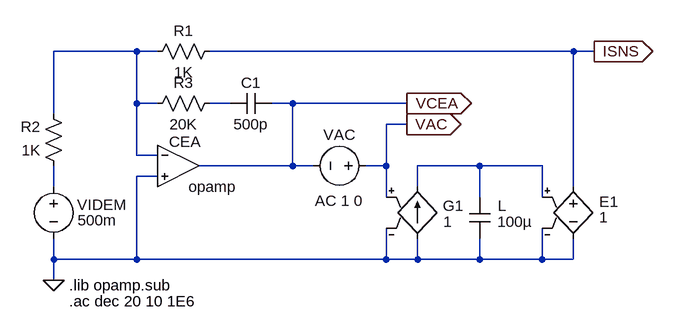
[diagram p0: schematic linmodb.asc]
linmodb.asc, the LTspice schematic file:
Version 4
SHEET 1 880 680
WIRE -304 112 -304 16
WIRE -304 224 -304 192
WIRE -304 336 -304 304
WIRE -304 368 -304 336
WIRE -176 16 -304 16
WIRE -176 96 -176 16
WIRE -176 176 -176 96
WIRE -176 336 -304 336
WIRE -176 336 -176 208
WIRE -144 16 -176 16
WIRE -144 96 -176 96
WIRE -144 176 -176 176
WIRE -144 208 -176 208
WIRE -32 96 -64 96
WIRE 64 96 32 96
WIRE 64 192 -80 192
WIRE 64 192 64 96
WIRE 96 192 64 192
WIRE 208 192 176 192
WIRE 208 192 208 128
WIRE 208 240 208 192
WIRE 208 336 -176 336
WIRE 208 336 208 288
WIRE 240 96 64 96
WIRE 240 128 208 128
WIRE 256 224 256 192
WIRE 256 336 208 336
WIRE 256 336 256 304
WIRE 352 192 256 192
WIRE 352 240 352 192
WIRE 352 336 256 336
WIRE 352 336 352 304
WIRE 448 192 352 192
WIRE 448 240 448 192
WIRE 448 336 352 336
WIRE 448 336 448 288
WIRE 496 16 -64 16
WIRE 496 224 496 16
WIRE 496 336 448 336
WIRE 496 336 496 304
WIRE 528 16 496 16
FLAG -304 368 0
FLAG 240 96 VCEA
IOPIN 240 96 Out
FLAG 240 128 VAC
IOPIN 240 128 Out
FLAG 528 16 ISNS
IOPIN 528 16 Out
SYMBOL cap 336 240 R0
WINDOW 0 44 13 Left 0
WINDOW 3 43 38 Left 0
SYMATTR InstName L
SYMATTR Value 100µ
SYMBOL g 256 208 R0
WINDOW 0 39 45 Left 0
WINDOW 3 40 70 Left 0
SYMATTR InstName G1
SYMATTR Value 1
SYMBOL Opamps\\opamp -112 128 R0
WINDOW 0 -14 27 Left 0
SYMATTR InstName CEA
SYMATTR SpiceLine2 GBW=2Meg
SYMBOL res -48 0 R90
WINDOW 0 0 56 VBottom 0
WINDOW 3 32 56 VTop 0
SYMATTR InstName R1
SYMATTR Value 1K
SYMBOL res -288 208 R180
WINDOW 0 36 76 Left 0
WINDOW 3 36 40 Left 0
SYMATTR InstName R2
SYMATTR Value 1K
SYMBOL res -160 112 R270
WINDOW 0 32 56 VTop 0
WINDOW 3 0 56 VBottom 0
SYMATTR InstName R3
SYMATTR Value 20K
SYMBOL voltage -304 208 R0
WINDOW 0 36 44 Left 0
WINDOW 3 37 68 Left 0
SYMATTR InstName VIDEM
SYMATTR Value 500m
SYMBOL e 496 208 R0
WINDOW 0 40 39 Left 0
WINDOW 3 40 63 Left 0
SYMATTR InstName E1
SYMATTR Value 1
SYMBOL voltage 192 192 R90
WINDOW 0 -32 56 VBottom 0
WINDOW 3 32 56 VTop 0
WINDOW 123 38 57 VTop 0
WINDOW 39 0 0 Left 0
SYMATTR InstName VAC
SYMATTR Value ""
SYMATTR Value2 AC 1 0
SYMBOL cap 32 80 R90
WINDOW 0 0 32 VBottom 0
WINDOW 3 32 32 VTop 0
SYMATTR InstName C1
SYMATTR Value 500p
TEXT -280 376 Left 0 !.lib opamp.sub
TEXT -280 400 Left 0 !.ac dec 20 10 1E6

The netlist it stands for:
* linmodb.asc
C§L N004 0 100µ
G1 0 N004 VAC 0 1
XCEA N001 0 VCEA opamp Aol=100K GBW=2Meg  ; pins invin noninvin out
R1 ISNS N001 1K
R2 N002 N001 1K
R3 N001 N003 20K
VIDEM N002 0 500m
E1 ISNS 0 N004 0 1
VAC VAC VCEA AC 1 0
C1 VCEA N003 500p
.lib opamp.sub
.ac dec 20 10 1E6
.backanno
.end